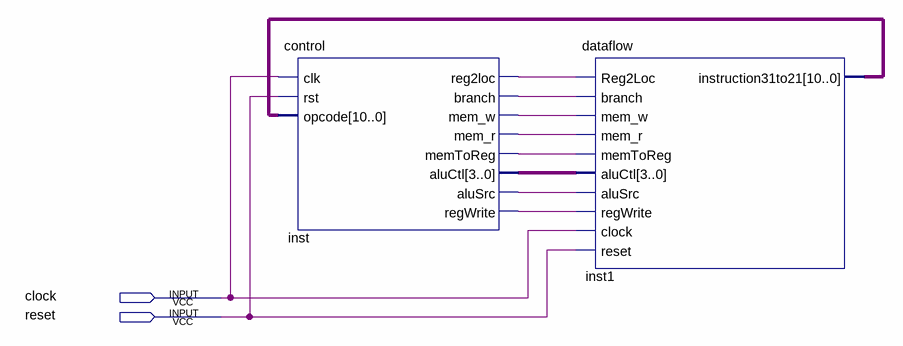
[diagram p0: schematic sheet]
// Quartus schematic blocos_pipeline.bdf as structural Verilog: 2 symbols, 2 pins
module blocos_pipeline (
  input  clock,
  input  reset
);

  wire inst_alusrc, inst_branch, inst_mem_r, inst_mem_w, inst_memtoreg, inst_reg2loc, inst_regwrite;
  wire [3:0] inst_aluctl;
  wire [10:0] inst1_instruction31to21;

  control inst (
    .clk(clock), .rst(reset), .opcode(inst1_instruction31to21), .reg2loc(inst_reg2loc), .branch(inst_branch),
    .mem_w(inst_mem_w), .mem_r(inst_mem_r), .memToReg(inst_memtoreg), .aluCtl(inst_aluctl),
    .aluSrc(inst_alusrc), .regWrite(inst_regwrite));
  dataflow inst1 (
    .Reg2Loc(inst_reg2loc), .branch(inst_branch), .memToReg(inst_memtoreg), .aluSrc(inst_alusrc),
    .regWrite(inst_regwrite), .reset(reset), .clock(clock), .mem_w(inst_mem_w), .mem_r(inst_mem_r),
    .aluCtl(inst_aluctl), .instruction31to21(inst1_instruction31to21));
endmodule
